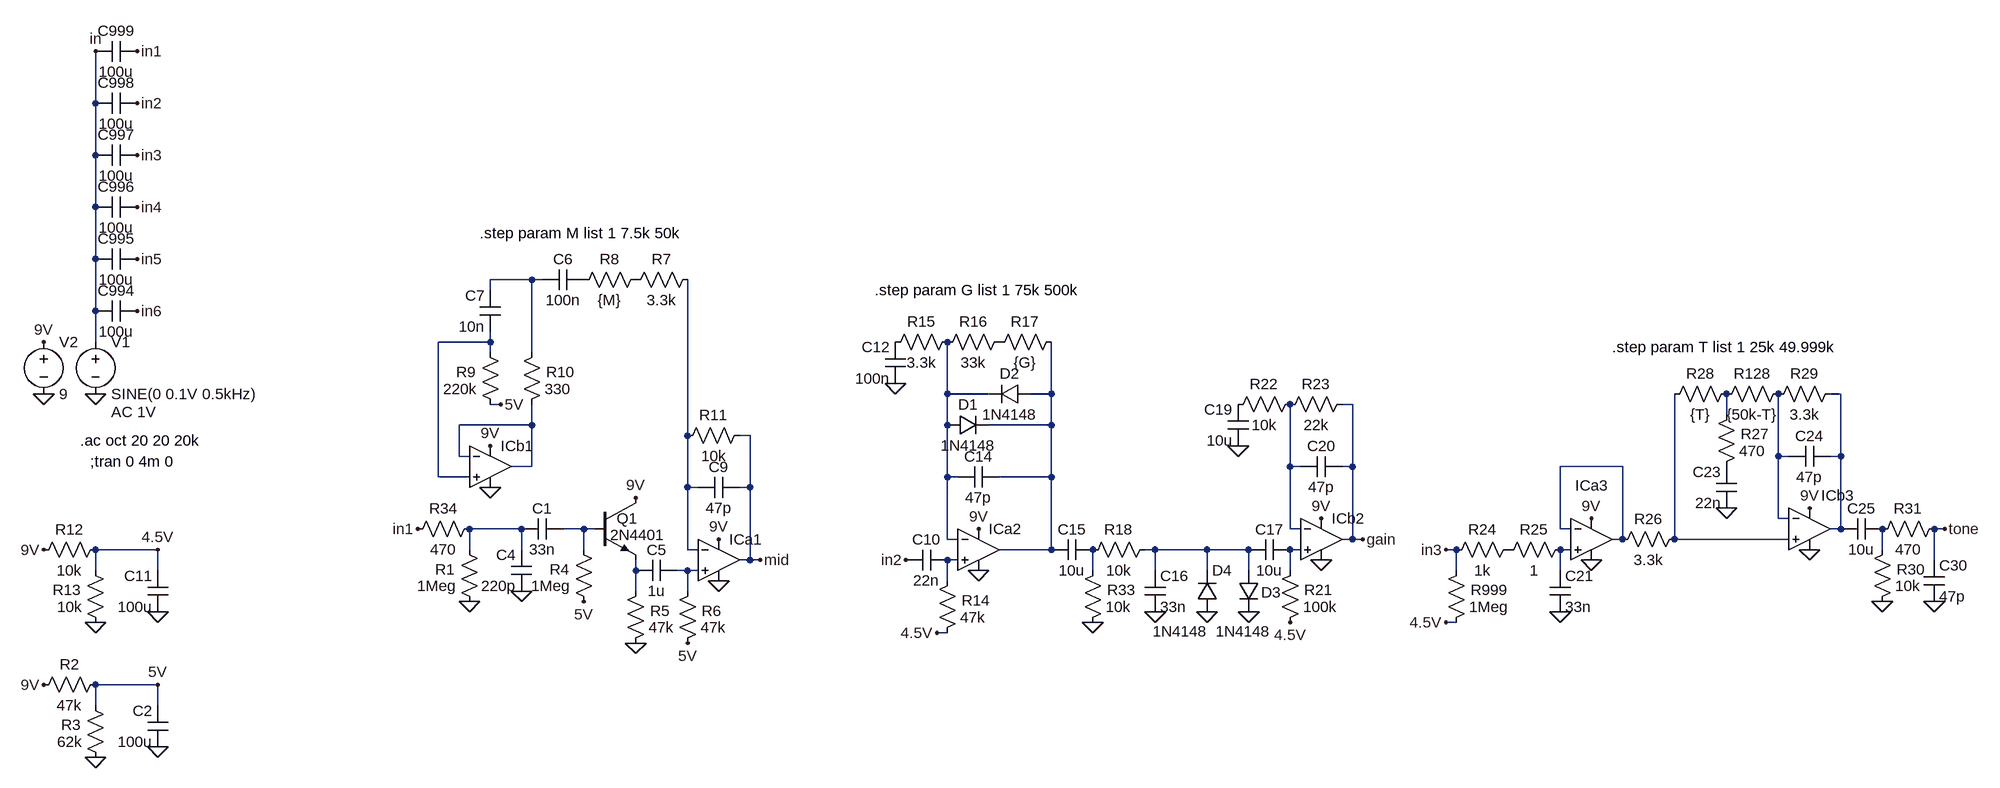
[diagram p0: schematic hammertone_od.asc]
hammertone_od.asc, the LTspice schematic file:
Version 4
SHEET 1 3200 3460
WIRE -1568 704 -1568 624
WIRE -1568 784 -1568 704
WIRE -1568 864 -1568 784
WIRE -1568 944 -1568 864
WIRE -896 976 -960 976
WIRE -880 976 -896 976
WIRE -960 992 -960 976
WIRE -1568 1024 -1568 944
WIRE -1568 1072 -1568 1024
WIRE -960 1072 -960 1056
WIRE -960 1072 -1040 1072
WIRE -960 1088 -960 1072
WIRE -896 1088 -896 976
WIRE -256 1152 -256 1072
WIRE -192 1152 -256 1152
WIRE -96 1152 -96 1072
WIRE -96 1152 -128 1152
WIRE 1120 1152 1104 1152
WIRE -944 1168 -960 1168
WIRE 368 1168 352 1168
WIRE 944 1184 944 1152
WIRE -896 1200 -896 1168
WIRE -896 1200 -1008 1200
WIRE -256 1200 -256 1152
WIRE -96 1200 -96 1152
WIRE -96 1200 -192 1200
WIRE -656 1216 -656 976
WIRE -560 1216 -576 1216
WIRE -1008 1248 -1008 1200
WIRE -992 1248 -1008 1248
WIRE 1024 1248 1024 1152
WIRE 1040 1248 1024 1248
WIRE 1120 1248 1120 1152
WIRE 1120 1248 1104 1248
WIRE -896 1264 -896 1200
WIRE -896 1264 -928 1264
WIRE 272 1264 272 1168
WIRE 288 1264 272 1264
WIRE 368 1264 368 1168
WIRE 368 1264 352 1264
WIRE 784 1264 688 1264
WIRE -1040 1280 -1040 1072
WIRE -992 1280 -1040 1280
WIRE -256 1280 -256 1200
WIRE -240 1280 -256 1280
WIRE -96 1280 -96 1200
WIRE -96 1280 -176 1280
WIRE -656 1296 -656 1216
WIRE -640 1296 -656 1296
WIRE -560 1296 -560 1216
WIRE -560 1296 -576 1296
WIRE 1024 1344 1024 1248
WIRE 1040 1344 1024 1344
WIRE -912 1360 -992 1360
WIRE -816 1360 -848 1360
WIRE -800 1360 -816 1360
WIRE 272 1360 272 1264
WIRE 288 1360 272 1360
WIRE 688 1360 688 1264
WIRE 704 1360 688 1360
WIRE 1120 1360 1120 1248
WIRE 1120 1360 1104 1360
WIRE 1280 1360 1264 1360
WIRE -256 1376 -256 1280
WIRE -240 1376 -256 1376
WIRE 368 1376 368 1264
WIRE 368 1376 352 1376
WIRE 384 1376 368 1376
WIRE 784 1376 784 1264
WIRE 784 1376 768 1376
WIRE 864 1376 864 1152
WIRE 1040 1376 864 1376
WIRE -1472 1392 -1568 1392
WIRE -992 1392 -992 1360
WIRE -912 1392 -912 1360
WIRE -816 1392 -816 1360
WIRE -656 1392 -656 1296
WIRE -640 1392 -656 1392
WIRE -96 1392 -96 1280
WIRE -96 1392 -176 1392
WIRE 64 1392 48 1392
WIRE 144 1392 64 1392
WIRE 208 1392 144 1392
WIRE 288 1392 272 1392
WIRE 528 1392 512 1392
WIRE 704 1392 688 1392
WIRE 1184 1392 1184 1360
WIRE -560 1408 -560 1296
WIRE -560 1408 -576 1408
WIRE -544 1408 -560 1408
WIRE -240 1408 -256 1408
WIRE 1264 1408 1264 1360
WIRE -1568 1424 -1568 1392
WIRE -1472 1424 -1472 1392
WIRE -736 1424 -736 1408
WIRE -656 1424 -672 1424
WIRE -640 1424 -656 1424
WIRE -32 1424 -32 1392
WIRE 64 1424 64 1392
WIRE 144 1424 144 1392
WIRE 208 1424 208 1392
WIRE 272 1424 272 1392
WIRE 528 1424 528 1392
WIRE 688 1424 688 1392
WIRE -256 1440 -256 1408
WIRE -736 1456 -736 1424
WIRE -656 1456 -656 1424
WIRE 528 1504 512 1504
WIRE -256 1520 -272 1520
WIRE -1472 1600 -1568 1600
WIRE -1568 1632 -1568 1600
WIRE -1472 1632 -1472 1600
FLAG -1568 1152 0
FLAG -1568 624 in
FLAG -1648 1152 0
FLAG -1648 1072 9V
FLAG -1504 624 in1
FLAG -1504 704 in2
FLAG -1504 784 in3
FLAG -1504 864 in4
FLAG -1504 944 in5
FLAG -1504 1024 in6
FLAG -1072 1360 in1
FLAG -736 1536 0
FLAG -736 1312 9V
FLAG -1648 1392 9V
FLAG -1568 1504 0
FLAG -1472 1488 0
FLAG -1472 1392 4.5V
FLAG -272 1520 4.5V
FLAG -208 1360 9V
FLAG -208 1424 0
FLAG -1648 1600 9V
FLAG -1568 1712 0
FLAG -1472 1696 0
FLAG -1472 1600 5V
FLAG -816 1472 5V
FLAG -912 1456 0
FLAG -992 1472 0
FLAG -656 1536 5V
FLAG -608 1376 9V
FLAG -608 1440 0
FLAG -960 1232 9V
FLAG -960 1296 0
FLAG -944 1168 5V
FLAG -336 1136 0
FLAG -32 1504 0
FLAG 64 1488 0
FLAG 144 1488 0
FLAG 208 1488 0
FLAG 320 1344 9V
FLAG 320 1408 0
FLAG 192 1232 0
FLAG 272 1504 4.5V
FLAG -320 1408 in2
FLAG 512 1504 4.5V
FLAG 736 1344 9V
FLAG 736 1408 0
FLAG 1072 1328 9V
FLAG 1072 1392 0
FLAG 944 1328 0
FLAG 512 1392 in3
FLAG 688 1488 0
FLAG 1184 1472 0
FLAG 1264 1472 0
FLAG -544 1408 mid
FLAG 384 1376 gain
FLAG 1280 1360 tone
SYMBOL voltage -1568 1056 R0
WINDOW 123 24 124 Left 2
WINDOW 39 0 0 Left 2
SYMATTR Value2 AC 1V
SYMATTR InstName V1
SYMATTR Value SINE(0 0.1V 0.5kHz)
SYMBOL voltage -1648 1056 R0
WINDOW 123 0 0 Left 0
WINDOW 39 0 0 Left 0
SYMATTR InstName V2
SYMATTR Value 9
SYMBOL cap -1504 688 R90
WINDOW 0 0 32 VBottom 2
WINDOW 3 32 32 VTop 2
SYMATTR InstName C998
SYMATTR Value 100u
SYMBOL cap -1504 768 R90
WINDOW 0 0 32 VBottom 2
WINDOW 3 32 32 VTop 2
SYMATTR InstName C997
SYMATTR Value 100u
SYMBOL cap -1504 848 R90
WINDOW 0 0 32 VBottom 2
WINDOW 3 32 32 VTop 2
SYMATTR InstName C996
SYMATTR Value 100u
SYMBOL cap -1504 608 R90
WINDOW 0 0 32 VBottom 2
WINDOW 3 32 32 VTop 2
SYMATTR InstName C999
SYMATTR Value 100u
SYMBOL cap -1504 928 R90
WINDOW 0 0 32 VBottom 2
WINDOW 3 32 32 VTop 2
SYMATTR InstName C995
SYMATTR Value 100u
SYMBOL cap -1504 1008 R90
WINDOW 0 0 32 VBottom 2
WINDOW 3 32 32 VTop 2
SYMATTR InstName C994
SYMATTR Value 100u
SYMBOL cap -848 1344 R90
WINDOW 0 0 32 VBottom 2
WINDOW 3 32 32 VTop 2
SYMATTR InstName C1
SYMATTR Value 33n
SYMBOL res -976 1488 R180
WINDOW 0 38 66 Left 2
WINDOW 3 36 40 Left 2
SYMATTR InstName R1
SYMATTR Value 1Meg
SYMBOL npn -800 1312 R0
WINDOW 0 35 32 Left 2
WINDOW 3 25 57 Left 2
SYMATTR InstName Q1
SYMATTR Value 2N4401
SYMBOL res -976 1344 R90
WINDOW 0 0 56 VBottom 2
WINDOW 3 32 56 VTop 2
SYMATTR InstName R34
SYMATTR Value 470
SYMBOL cap -896 1456 R180
WINDOW 0 24 56 Left 2
WINDOW 3 24 8 Left 2
SYMATTR InstName C4
SYMATTR Value 220p
SYMBOL res -752 1552 M180
WINDOW 0 38 66 Left 2
WINDOW 3 36 40 Left 2
SYMATTR InstName R5
SYMATTR Value 47k
SYMBOL cap -672 1408 R90
WINDOW 0 0 32 VBottom 2
WINDOW 3 32 32 VTop 2
SYMATTR InstName C5
SYMATTR Value 1u
SYMBOL res -1552 1376 R90
WINDOW 0 0 56 VBottom 2
WINDOW 3 32 56 VTop 2
SYMATTR InstName R12
SYMATTR Value 10k
SYMBOL res -1552 1520 R180
WINDOW 0 38 66 Left 2
WINDOW 3 36 40 Left 2
SYMATTR InstName R13
SYMATTR Value 10k
SYMBOL cap -1456 1488 R180
WINDOW 0 24 56 Left 2
WINDOW 3 24 8 Left 2
SYMATTR InstName C11
SYMATTR Value 100u
SYMBOL Opamps\\UniversalOpamp2 -208 1392 R0
SYMATTR InstName ICa2
SYMBOL cap -176 1264 R90
WINDOW 0 0 32 VBottom 2
WINDOW 3 32 32 VTop 2
SYMATTR InstName C14
SYMATTR Value 47p
SYMBOL res -160 1056 R90
WINDOW 0 0 56 VBottom 2
WINDOW 3 32 56 VTop 2
SYMATTR InstName R16
SYMATTR Value 33k
SYMBOL diode -256 1216 R270
WINDOW 0 32 32 VTop 2
WINDOW 3 0 32 VBottom 2
SYMATTR InstName D1
SYMATTR Value 1N4148
SYMBOL diode -128 1168 M270
WINDOW 0 32 32 VTop 2
WINDOW 3 0 32 VBottom 2
SYMATTR InstName D2
SYMATTR Value 1N4148
SYMBOL res -80 1056 R90
WINDOW 0 0 56 VBottom 2
WINDOW 3 32 56 VTop 2
SYMATTR InstName R17
SYMATTR Value {G}
SYMBOL res -1552 1584 R90
WINDOW 0 0 56 VBottom 2
WINDOW 3 32 56 VTop 2
SYMATTR InstName R2
SYMATTR Value 47k
SYMBOL res -1552 1728 R180
WINDOW 0 38 66 Left 2
WINDOW 3 36 40 Left 2
SYMATTR InstName R3
SYMATTR Value 62k
SYMBOL cap -1456 1696 R180
WINDOW 0 24 56 Left 2
WINDOW 3 24 8 Left 2
SYMATTR InstName C2
SYMATTR Value 100u
SYMBOL res -800 1488 R180
WINDOW 0 38 66 Left 2
WINDOW 3 36 40 Left 2
SYMATTR InstName R4
SYMATTR Value 1Meg
SYMBOL Opamps\\UniversalOpamp2 -608 1408 R0
SYMATTR InstName ICa1
SYMBOL res -672 1552 M180
WINDOW 0 38 66 Left 2
WINDOW 3 36 40 Left 2
SYMATTR InstName R6
SYMATTR Value 47k
SYMBOL cap -576 1280 R90
WINDOW 0 0 32 VBottom 2
WINDOW 3 32 32 VTop 2
SYMATTR InstName C9
SYMATTR Value 47p
SYMBOL res -560 1200 R90
WINDOW 0 0 56 VBottom 2
WINDOW 3 32 56 VTop 2
SYMATTR InstName R11
SYMATTR Value 10k
SYMBOL res -640 960 R90
WINDOW 0 0 56 VBottom 2
WINDOW 3 32 56 VTop 2
SYMATTR InstName R7
SYMATTR Value 3.3k
SYMBOL res -720 960 R90
WINDOW 0 0 56 VBottom 2
WINDOW 3 32 56 VTop 2
SYMATTR InstName R8
SYMATTR Value {M}
SYMBOL cap -816 960 R90
WINDOW 0 0 32 VBottom 2
WINDOW 3 32 32 VTop 2
SYMATTR InstName C6
SYMATTR Value 100n
SYMBOL Opamps\\UniversalOpamp2 -960 1264 R0
SYMATTR InstName ICb1
SYMBOL res -912 1184 M180
WINDOW 0 38 66 Left 2
WINDOW 3 36 40 Left 2
SYMATTR InstName R10
SYMATTR Value 330
SYMBOL res -944 1184 R180
WINDOW 0 38 66 Left 2
WINDOW 3 36 40 Left 2
SYMATTR InstName R9
SYMATTR Value 220k
SYMBOL cap -944 1056 R180
WINDOW 0 24 56 Left 2
WINDOW 3 24 8 Left 2
SYMATTR InstName C7
SYMATTR Value 10n
SYMBOL cap -256 1392 R90
WINDOW 0 0 32 VBottom 2
WINDOW 3 32 32 VTop 2
SYMATTR InstName C10
SYMATTR Value 22n
SYMBOL res -272 1536 M180
WINDOW 0 38 66 Left 2
WINDOW 3 36 40 Left 2
SYMATTR InstName R14
SYMATTR Value 47k
SYMBOL res -240 1056 R90
WINDOW 0 0 56 VBottom 2
WINDOW 3 32 56 VTop 2
SYMATTR InstName R15
SYMATTR Value 3.3k
SYMBOL cap -320 1136 R180
WINDOW 0 24 56 Left 2
WINDOW 3 24 8 Left 2
SYMATTR InstName C12
SYMATTR Value 100n
SYMBOL cap -32 1376 R90
WINDOW 0 0 32 VBottom 2
WINDOW 3 32 32 VTop 2
SYMATTR InstName C15
SYMATTR Value 10u
SYMBOL res -48 1520 M180
WINDOW 0 38 66 Left 2
WINDOW 3 36 40 Left 2
SYMATTR InstName R33
SYMATTR Value 10k
SYMBOL res 64 1376 R90
WINDOW 0 0 56 VBottom 2
WINDOW 3 32 56 VTop 2
SYMATTR InstName R18
SYMATTR Value 10k
SYMBOL cap 48 1488 M180
WINDOW 0 24 56 Left 2
WINDOW 3 24 8 Left 2
SYMATTR InstName C16
SYMATTR Value 33n
SYMBOL diode 128 1488 M180
WINDOW 0 24 64 Left 2
WINDOW 3 -68 -30 Left 2
SYMATTR InstName D4
SYMATTR Value 1N4148
SYMBOL diode 224 1424 M0
WINDOW 0 -34 34 Left 2
WINDOW 3 -18 94 Left 2
SYMATTR InstName D3
SYMATTR Value 1N4148
SYMBOL cap 272 1376 R90
WINDOW 0 0 32 VBottom 2
WINDOW 3 32 32 VTop 2
SYMATTR InstName C17
SYMATTR Value 10u
SYMBOL res 256 1520 M180
WINDOW 0 38 66 Left 2
WINDOW 3 36 40 Left 2
SYMATTR InstName R21
SYMATTR Value 100k
SYMBOL Opamps\\UniversalOpamp2 320 1376 R0
SYMATTR InstName ICb2
SYMBOL cap 352 1248 R90
WINDOW 0 0 32 VBottom 2
WINDOW 3 32 32 VTop 2
SYMATTR InstName C20
SYMATTR Value 47p
SYMBOL res 368 1152 R90
WINDOW 0 0 56 VBottom 2
WINDOW 3 32 56 VTop 2
SYMATTR InstName R23
SYMATTR Value 22k
SYMBOL res 288 1152 R90
WINDOW 0 0 56 VBottom 2
WINDOW 3 32 56 VTop 2
SYMATTR InstName R22
SYMATTR Value 10k
SYMBOL cap 208 1232 R180
WINDOW 0 24 56 Left 2
WINDOW 3 24 8 Left 2
SYMATTR InstName C19
SYMATTR Value 10u
SYMBOL Opamps\\UniversalOpamp2 736 1376 R0
WINDOW 0 -25 -83 Left 2
SYMATTR InstName ICa3
SYMBOL res 512 1520 M180
WINDOW 0 38 66 Left 2
WINDOW 3 36 40 Left 2
SYMATTR InstName R999
SYMATTR Value 1Meg
SYMBOL res 880 1360 R90
WINDOW 0 0 56 VBottom 2
WINDOW 3 32 56 VTop 2
SYMATTR InstName R26
SYMATTR Value 3.3k
SYMBOL Opamps\\UniversalOpamp2 1072 1360 R0
WINDOW 0 18 -52 Left 2
SYMATTR InstName ICb3
SYMBOL cap 1104 1232 R90
WINDOW 0 0 32 VBottom 2
WINDOW 3 32 32 VTop 2
SYMATTR InstName C24
SYMATTR Value 47p
SYMBOL res 1120 1136 R90
WINDOW 0 0 56 VBottom 2
WINDOW 3 32 56 VTop 2
SYMATTR InstName R29
SYMATTR Value 3.3k
SYMBOL res 1040 1136 R90
WINDOW 0 0 56 VBottom 2
WINDOW 3 32 56 VTop 2
SYMATTR InstName R128
SYMATTR Value {50k-T}
SYMBOL cap 960 1328 R180
WINDOW 0 24 56 Left 2
WINDOW 3 24 8 Left 2
SYMATTR InstName C23
SYMATTR Value 22n
SYMBOL cap 672 1488 M180
WINDOW 0 24 56 Left 2
WINDOW 3 24 8 Left 2
SYMATTR InstName C21
SYMATTR Value 33n
SYMBOL res 704 1376 R90
WINDOW 0 0 56 VBottom 2
WINDOW 3 32 56 VTop 2
SYMATTR InstName R25
SYMATTR Value 1
SYMBOL res 624 1376 R90
WINDOW 0 0 56 VBottom 2
WINDOW 3 32 56 VTop 2
SYMATTR InstName R24
SYMATTR Value 1k
SYMBOL res 928 1280 M180
WINDOW 0 38 66 Left 2
WINDOW 3 36 40 Left 2
SYMATTR InstName R27
SYMATTR Value 470
SYMBOL res 960 1136 R90
WINDOW 0 0 56 VBottom 2
WINDOW 3 32 56 VTop 2
SYMATTR InstName R28
SYMATTR Value {T}
SYMBOL cap 1184 1344 R90
WINDOW 0 0 32 VBottom 2
WINDOW 3 32 32 VTop 2
SYMATTR InstName C25
SYMATTR Value 10u
SYMBOL res 1168 1488 M180
WINDOW 0 38 66 Left 2
WINDOW 3 36 40 Left 2
SYMATTR InstName R30
SYMATTR Value 10k
SYMBOL res 1280 1344 R90
WINDOW 0 0 56 VBottom 2
WINDOW 3 32 56 VTop 2
SYMATTR InstName R31
SYMATTR Value 470
SYMBOL cap 1248 1472 M180
WINDOW 0 24 56 Left 2
WINDOW 3 24 8 Left 2
SYMATTR InstName C30
SYMATTR Value 47p
TEXT -1592 1224 Left 2 !.ac oct 20 20 20k
TEXT -1576 1256 Left 2 !;tran 0 4m 0
TEXT -976 904 Left 2 !.step param M list 1 7.5k 50k
TEXT 768 1080 Left 2 !.step param T list 1 25k 49.999k
TEXT -368 992 Left 2 !.step param G list 1 75k 500k

The netlist it stands for:
* hammertone_od.asc
V1 in 0 SINE(0 0.1V 0.5kHz) AC 1V
V2 9V 0 9
C998 in2 in 100u
C997 in3 in 100u
C996 in4 in 100u
C999 in1 in 100u
C995 in5 in 100u
C994 in6 in 100u
C1 N013 N012 33n
R1 0 N012 1Meg
Q1 9V N013 N020 0 2N4401
R34 N012 in1 470
C4 0 N012 220p
R5 0 N020 47k
C5 N021 N020 1u
R12 4.5V 9V 10k
R13 0 4.5V 10k
C11 0 4.5V 100u
XICa2 N019 N003 9V 0 N004 level.2 Avol=1Meg GBW=10Meg Slew=10Meg ilimit=25m rail=0 Vos=0 phimargin=45 en=0 enk=0 in=0 ink=0 Rin=500Meg  ; pins IN+ IN- V+ V- OUT
C14 N004 N003 47p
R16 P001 N003 33k
D1 N003 N004 1N4148
D2 N004 N003 1N4148
R17 N004 P001 {G}
R2 5V 9V 47k
R3 0 5V 62k
C2 0 5V 100u
R4 5V N013 1Meg
XICa1 N021 N008 9V 0 mid level.2 Avol=1Meg GBW=10Meg Slew=10Meg ilimit=25m rail=0 Vos=0 phimargin=45 en=0 enk=0 in=0 ink=0 Rin=500Meg  ; pins IN+ IN- V+ V- OUT
R6 5V N021 47k
C9 mid N008 47p
R11 mid N008 10k
R7 N008 P002 3.3k
R8 P002 P003 {M}
C6 P003 N001 100n
XICb1 N002 N007 9V 0 N007 level.2 Avol=1Meg GBW=10Meg Slew=10Meg ilimit=25m rail=0 Vos=0 phimargin=45 en=0 enk=0 in=0 ink=0 Rin=500Meg  ; pins IN+ IN- V+ V- OUT
R10 N007 N001 330
R9 5V N002 220k
C7 N002 N001 10n
C10 N019 in2 22n
R14 4.5V N019 47k
R15 N003 P004 3.3k
C12 0 P004 100n
C15 N022 N004 10u
R33 0 N022 10k
R18 N015 N022 10k
C16 0 N015 33n
D4 0 N015 1N4148
D3 N015 0 1N4148
C17 N016 N015 10u
R21 4.5V N016 100k
XICb2 N016 N010 9V 0 gain level.2 Avol=1Meg GBW=10Meg Slew=10Meg ilimit=25m rail=0 Vos=0 phimargin=45 en=0 enk=0 in=0 ink=0 Rin=500Meg  ; pins IN+ IN- V+ V- OUT
C20 gain N010 47p
R23 gain N010 22k
R22 N010 P005 10k
C19 0 P005 10u
XICa3 N017 N011 9V 0 N011 level.2 Avol=1Meg GBW=10Meg Slew=10Meg ilimit=25m rail=0 Vos=0 phimargin=45 en=0 enk=0 in=0 ink=0 Rin=500Meg  ; pins IN+ IN- V+ V- OUT
R999 4.5V in3 1Meg
R26 N014 N011 3.3k
XICb3 N014 N009 9V 0 N005 level.2 Avol=1Meg GBW=10Meg Slew=10Meg ilimit=25m rail=0 Vos=0 phimargin=45 en=0 enk=0 in=0 ink=0 Rin=500Meg  ; pins IN+ IN- V+ V- OUT
C24 N005 N009 47p
R29 N005 N009 3.3k
R128 N009 N006 {50k-T}
C23 0 P006 22n
C21 0 N017 33n
R25 N017 P007 1
R24 P007 in3 1k
R27 P006 N006 470
R28 N006 N014 {T}
C25 N018 N005 10u
R30 0 N018 10k
R31 tone N018 470
C30 0 tone 47p
.model D D
.lib standard.dio
.model NPN NPN
.model PNP PNP
.lib standard.bjt
.ac oct 20 20 20k
;tran 0 4m 0
.step param M list 1 7.5k 50k
.step param T list 1 25k 49.999k
.step param G list 1 75k 500k
.lib UniversalOpamps2.sub
.backanno
.end